# EAGLE schematic fpc (EAGLE 6.5.0)
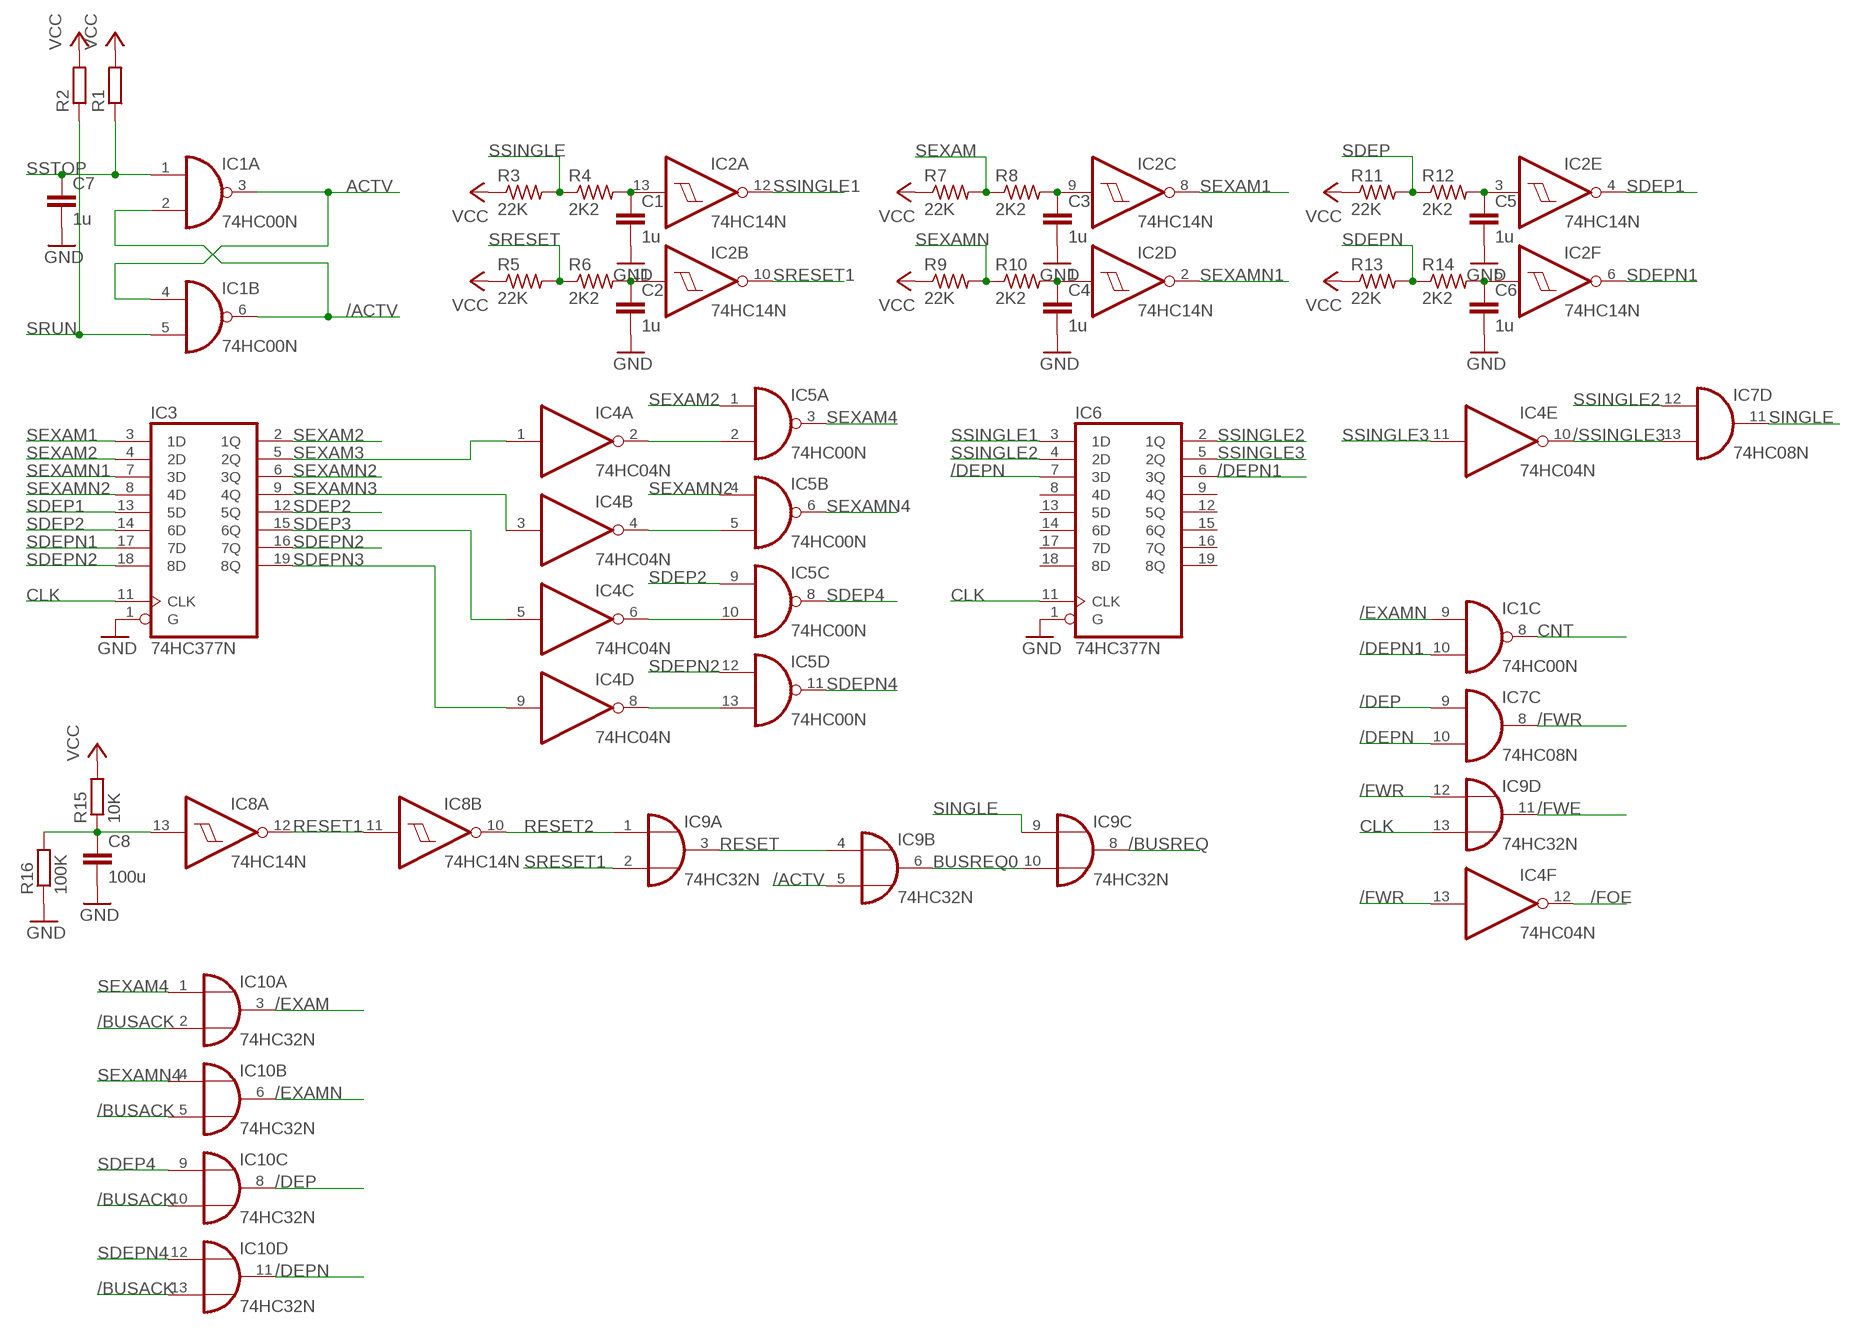
[diagram p0: schematic, sheet 1]

## Parts
C1  1u  C-EU025-025X050  [C025-025X050]
C2  1u  C-EU025-025X050  [C025-025X050]
C3  1u  C-EU025-025X050  [C025-025X050]
C4  1u  C-EU025-025X050  [C025-025X050]
C5  1u  C-EU025-025X050  [C025-025X050]
C6  1u  C-EU025-025X050  [C025-025X050]
C7  1u  C-EU025-025X050  [C025-025X050]
C8  100u  C-EU025-025X050  [C025-025X050]
IC1  74HC00N  [DIL14]
IC2  74HC14N  [DIL14]
IC3  74HC377N  [DIL20]
IC4  74HC04N  [DIL14]
IC5  74HC00N  [DIL14]
IC6  74HC377N  [DIL20]
IC7  74HC08N  [DIL14]
IC8  74HC14N  [DIL14]
IC9  74HC32N  [DIL14]
IC10  74HC32N  [DIL14]
R1  R-EU_0309/12  [0309/12]
R2  R-EU_0309/12  [0309/12]
R3  22K  R-US_0204/7  [0204/7]
R4  2K2  R-US_0204/7  [0204/7]
R5  22K  R-US_0204/7  [0204/7]
R6  2K2  R-US_0204/7  [0204/7]
R7  22K  R-US_0204/7  [0204/7]
R8  2K2  R-US_0204/7  [0204/7]
R9  22K  R-US_0204/7  [0204/7]
R10  2K2  R-US_0204/7  [0204/7]
R11  22K  R-US_0204/7  [0204/7]
R12  2K2  R-US_0204/7  [0204/7]
R13  22K  R-US_0204/7  [0204/7]
R14  2K2  R-US_0204/7  [0204/7]
R15  10K  R-EU_0309/12  [0309/12]
R16  100K  R-EU_0309/12  [0309/12]

## Nets
/ACTV: IC1.2(A:I1) IC1.6(B:O) IC9.5(B:I1)
/BUSACK: IC10.2(A:I1) IC10.5(B:I1) IC10.10(C:I1) IC10.13(D:I1)
/BUSREQ: IC9.8(C:O)
/DEP: IC7.9(C:I0) IC10.8(C:O)
/DEPN: IC6.7(3D) IC7.10(C:I1) IC10.11(D:O)
/DEPN1: IC1.10(C:I1) IC6.6(3Q)
/EXAM: IC10.3(A:O)
/EXAMN: IC1.9(C:I0) IC10.6(B:O)
/FOE: IC4.12(F:O)
/FWE: IC9.11(D:O)
/FWR: IC4.13(F:I) IC7.8(C:O) IC9.12(D:I0)
/SDEP3: IC4.6(C:O) IC5.10(C:I1)
/SDEPN3: IC4.8(D:O) IC5.13(D:I1)
/SEXAMN3: IC4.4(B:O) IC5.5(B:I1)
/SSINGLE3: IC4.2(A:O) IC4.10(E:O) IC5.2(A:I1) IC7.13(D:I1)
ACTV: IC1.3(A:O) IC1.4(B:I0)
BUSREQ0: IC9.6(B:O) IC9.10(C:I1)
CLK: IC3.11(CLK) IC6.11(CLK) IC9.13(D:I1)
CNT: IC1.8(C:O)
GND: C1.2 C2.2 C3.2 C4.2 C5.2 C6.2 C7.2 C8.2 IC3.1(G) IC6.1(G) R16.1
RESET: IC9.3(A:O) IC9.4(B:I0)
RESET0: C8.1 IC8.13(A:I) R15.1 R16.2
RESET1: IC8.11(B:I) IC8.12(A:O)
RESET2: IC8.10(B:O) IC9.1(A:I0)
SDEP: R11.2 R12.1
SDEP0: C5.1 IC2.3(E:I) R12.2
SDEP1: IC2.4(E:O) IC3.13(5D)
SDEP2: IC3.12(5Q) IC3.14(6D) IC5.9(C:I0)
SDEP3: IC3.15(6Q) IC4.5(C:I)
SDEP4: IC5.8(C:O) IC10.9(C:I0)
SDEPN: R13.2 R14.1
SDEPN0: C6.1 IC2.5(F:I) R14.2
SDEPN1: IC2.6(F:O) IC3.17(7D)
SDEPN2: IC3.16(7Q) IC3.18(8D) IC5.12(D:I0)
SDEPN3: IC3.19(8Q) IC4.9(D:I)
SDEPN4: IC5.11(D:O) IC10.12(D:I0)
SEXAM: R7.2 R8.1
SEXAM0: C3.1 IC2.9(C:I) R8.2
SEXAM1: IC2.8(C:O) IC3.3(1D)
SEXAM2: IC3.2(1Q) IC3.4(2D) IC5.1(A:I0)
SEXAM3: IC3.5(2Q) IC4.1(A:I)
SEXAM4: IC5.3(A:O) IC10.1(A:I0)
SEXAMN: R9.2 R10.1
SEXAMN0: C4.1 IC2.1(D:I) R10.2
SEXAMN1: IC2.2(D:O) IC3.7(3D)
SEXAMN2: IC3.6(3Q) IC3.8(4D) IC5.4(B:I0)
SEXAMN3: IC3.9(4Q) IC4.3(B:I)
SEXAMN4: IC5.6(B:O) IC10.4(B:I0)
SINGLE: IC7.11(D:O) IC9.9(C:I0)
SRESET: R5.2 R6.1
SRESET0: C2.1 IC2.11(B:I) R6.2
SRESET1: IC2.10(B:O) IC9.2(A:I1)
SRUN: IC1.5(B:I1) R2.1
SSINGLE: R3.2 R4.1
SSINGLE0: C1.1 IC2.13(A:I) R4.2
SSINGLE1: IC2.12(A:O) IC6.3(1D)
SSINGLE2: IC6.2(1Q) IC6.4(2D) IC7.12(D:I0)
SSINGLE3: IC4.11(E:I) IC6.5(2Q)
SSTOP: C7.1 IC1.1(A:I0) R1.1
VCC: R1.2 R2.2 R3.1 R5.1 R7.1 R9.1 R11.1 R13.1 R15.2
Unconnected: IC1.11(D:O) IC1.12(D:I0) IC1.13(D:I1) IC6.8(4D) IC6.9(4Q) IC6.12(5Q) IC6.13(5D) IC6.14(6D) IC6.15(6Q) IC6.16(7Q) IC6.17(7D) IC6.18(8D) IC6.19(8Q) IC7.1(A:I0) IC7.2(A:I1) IC7.3(A:O) IC7.4(B:I0) IC7.5(B:I1) IC7.6(B:O) IC8.1(D:I) IC8.2(D:O) IC8.3(E:I) IC8.4(E:O) IC8.5(F:I) IC8.6(F:O) IC8.8(C:O) IC8.9(C:I)

## Power pins joined to a net without a drawn wire
GND: IC1.7(P:GND) IC2.7(P:GND) IC3.10(GND) IC4.7(P:GND) IC5.7(P:GND) IC6.10(GND) IC7.7(P:GND) IC8.7(P:GND) IC9.7(P:GND) IC10.7(P:GND)
VCC: IC1.14(P:VCC) IC2.14(P:VCC) IC3.20(VCC) IC4.14(P:VCC) IC5.14(P:VCC) IC6.20(VCC) IC7.14(P:VCC) IC8.14(P:VCC) IC9.14(P:VCC) IC10.14(P:VCC)

## Library data of the parts
C1-C8 = rcl:C-EU: CAPACITOR, European symbol
IC1 IC5 = 74xx-eu:74*00: Quad 2-input NAND gate
IC2 IC8 = 74xx-eu:74*14: Hex schmitt trigger INVERTER
IC3 IC6 = 74xx-eu:74*377: Octal D type FLIP FLOP, enable
IC4 = 74xx-eu:74*04: Hex INVERTER
IC7 = 74xx-eu:74*08: Quad 2-input AND gate
IC9 IC10 = 74xx-eu:74*32: Quad 2-input OR gate
R1 R2 R15 R16 = rcl:R-EU_: RESISTOR, European symbol
R3-R14 = rcl:R-US_: RESISTOR, American symbol